# EAGLE design xcr3064xl_breakout (EAGLE 6.1)
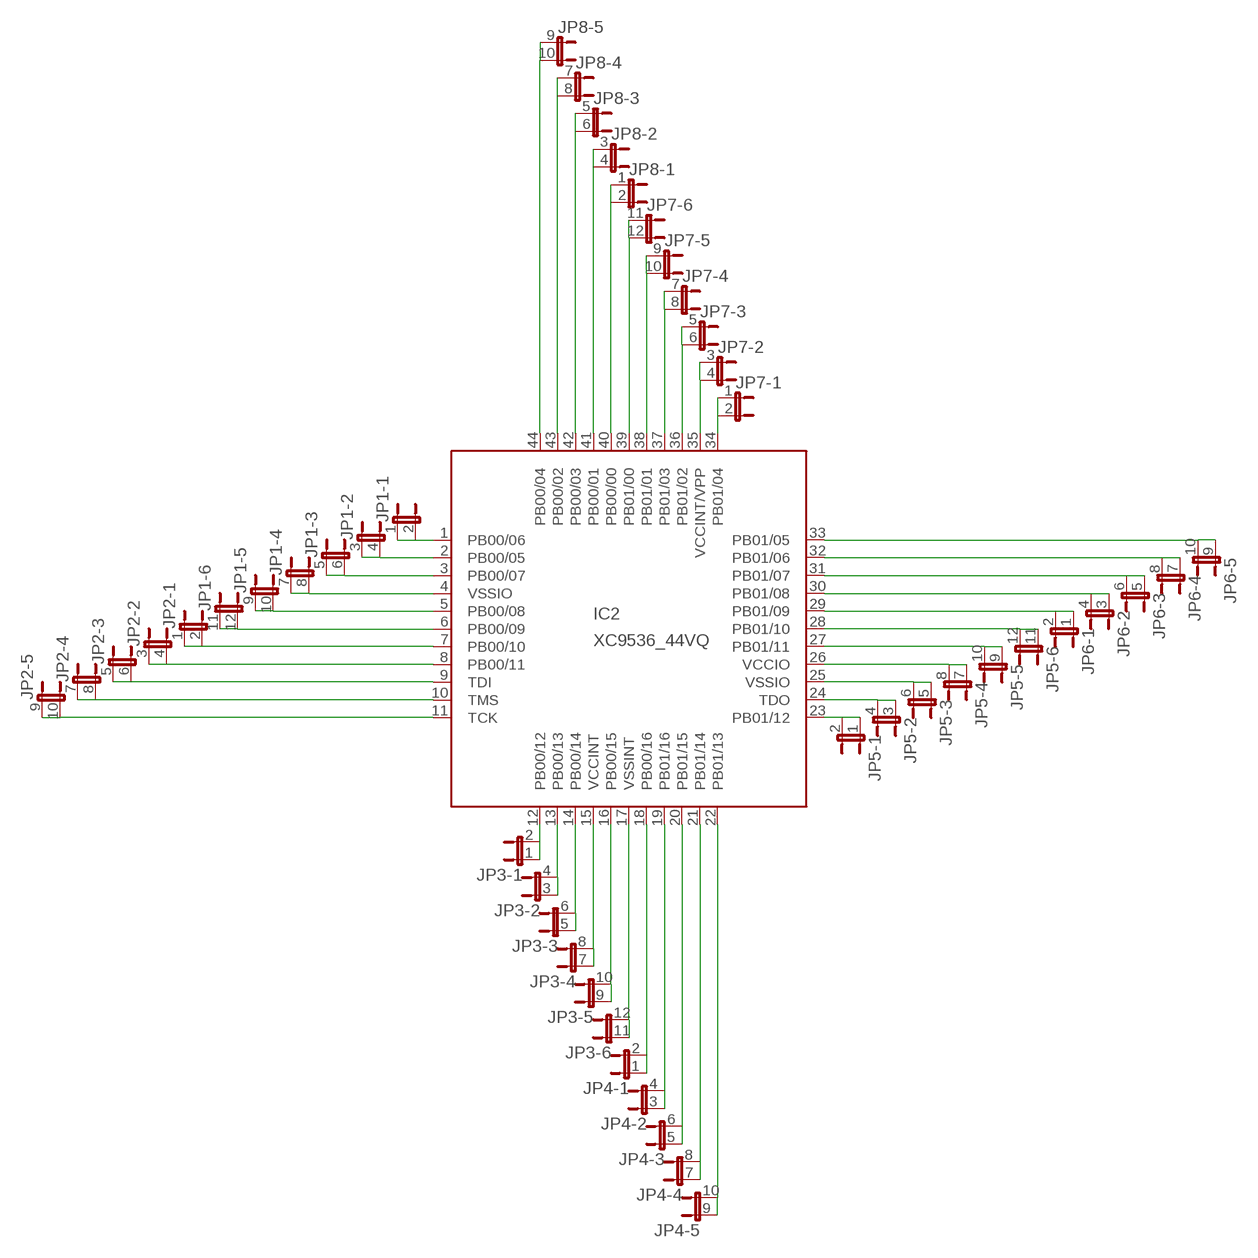
[diagram p0: schematic, sheet 1]

## Parts
IC2  XC9536_44VQ  [SQFP-S-10X10-44]
JP1  JP6QE  [JP6Q]
JP2  JP6QE  [JP6Q]
JP3  JP6QE  [JP6Q]
JP4  JP6QE  [JP6Q]
JP5  JP6QE  [JP6Q]
JP6  JP6QE  [JP6Q]
JP7  JP6QE  [JP6Q]
JP8  JP6QE  [JP6Q]

## Nets
N$1: IC2.1(PB00/06) JP1.1 JP1.2
N$2: IC2.2(PB00/05) JP1.3 JP1.4
N$3: IC2.3(PB00/07) JP1.5 JP1.6
N$4: IC2.4(VSSIO) JP1.7 JP1.8
N$5: IC2.5(PB00/08) JP1.9 JP1.10
N$6: IC2.6(PB00/09) JP1.11 JP1.12
N$7: IC2.7(PB00/10) JP2.1 JP2.2
N$8: IC2.8(PB00/11) JP2.3 JP2.4
N$9: IC2.9(TDI) JP2.5 JP2.6
N$10: IC2.10(TMS) JP2.7 JP2.8
N$11: IC2.11(TCK) JP2.9 JP2.10
N$12: IC2.12(PB00/12) JP3.1 JP3.2
N$13: IC2.13(PB00/13) JP3.3 JP3.4
N$14: IC2.14(PB00/14) JP3.5 JP3.6
N$15: IC2.15(VCCINT) JP3.7 JP3.8
N$16: IC2.16(PB00/15) JP3.9 JP3.10
N$17: IC2.17(VSSINT) JP3.11 JP3.12
N$18: IC2.18(PB00/16) JP4.1 JP4.2
N$19: IC2.19(PB01/16) JP4.3 JP4.4
N$20: IC2.20(PB01/15) JP4.5 JP4.6
N$21: IC2.21(PB01/14) JP4.7 JP4.8
N$22: IC2.22(PB01/13) JP4.9 JP4.10
N$23: IC2.23(PB01/12) JP5.1 JP5.2
N$24: IC2.24(TDO) JP5.3 JP5.4
N$25: IC2.25(VSSIO) JP5.5 JP5.6
N$26: IC2.26(VCCIO) JP5.7 JP5.8
N$27: IC2.27(PB01/11) JP5.9 JP5.10
N$28: IC2.28(PB01/10) JP5.11 JP5.12
N$29: IC2.29(PB01/09) JP6.1 JP6.2
N$30: IC2.30(PB01/08) JP6.3 JP6.4
N$31: IC2.31(PB01/07) JP6.5 JP6.6
N$32: IC2.32(PB01/06) JP6.7 JP6.8
N$33: IC2.33(PB01/05) JP6.9 JP6.10
N$34: IC2.34(PB01/04) JP7.1 JP7.2
N$35: IC2.35(VCCINT/VPP) JP7.3 JP7.4
N$36: IC2.36(PB01/02) JP7.5 JP7.6
N$37: IC2.37(PB01/03) JP7.7 JP7.8
N$38: IC2.38(PB01/01) JP7.9 JP7.10
N$39: IC2.39(PB01/00) JP7.11 JP7.12
N$40: IC2.40(PB00/00) JP8.1 JP8.2
N$41: IC2.41(PB00/01) JP8.3 JP8.4
N$42: IC2.42(PB00/03) JP8.5 JP8.6
N$43: IC2.43(PB00/02) JP8.7 JP8.8
N$44: IC2.44(PB00/04) JP8.9 JP8.10
Unconnected: JP2.11 JP2.12 JP4.11 JP4.12 JP6.11 JP6.12 JP8.11 JP8.12

## Library data of the parts
IC2 = xilinx-xc9:XC9536_44VQ: xc9536_pc44 XC9500 In-System Programmable CPLD Family Auto generated by make-symbol-device-package-bsdl.ulp Rev. 34 Source: xc9536_vq44.bsd; MPN: XC9536-15VQG44C; OC_FARNELL: 1193227; OC_NEWARK: 98K3377
JP1-JP8 = jumper:JP6QE: JUMPER

## Board
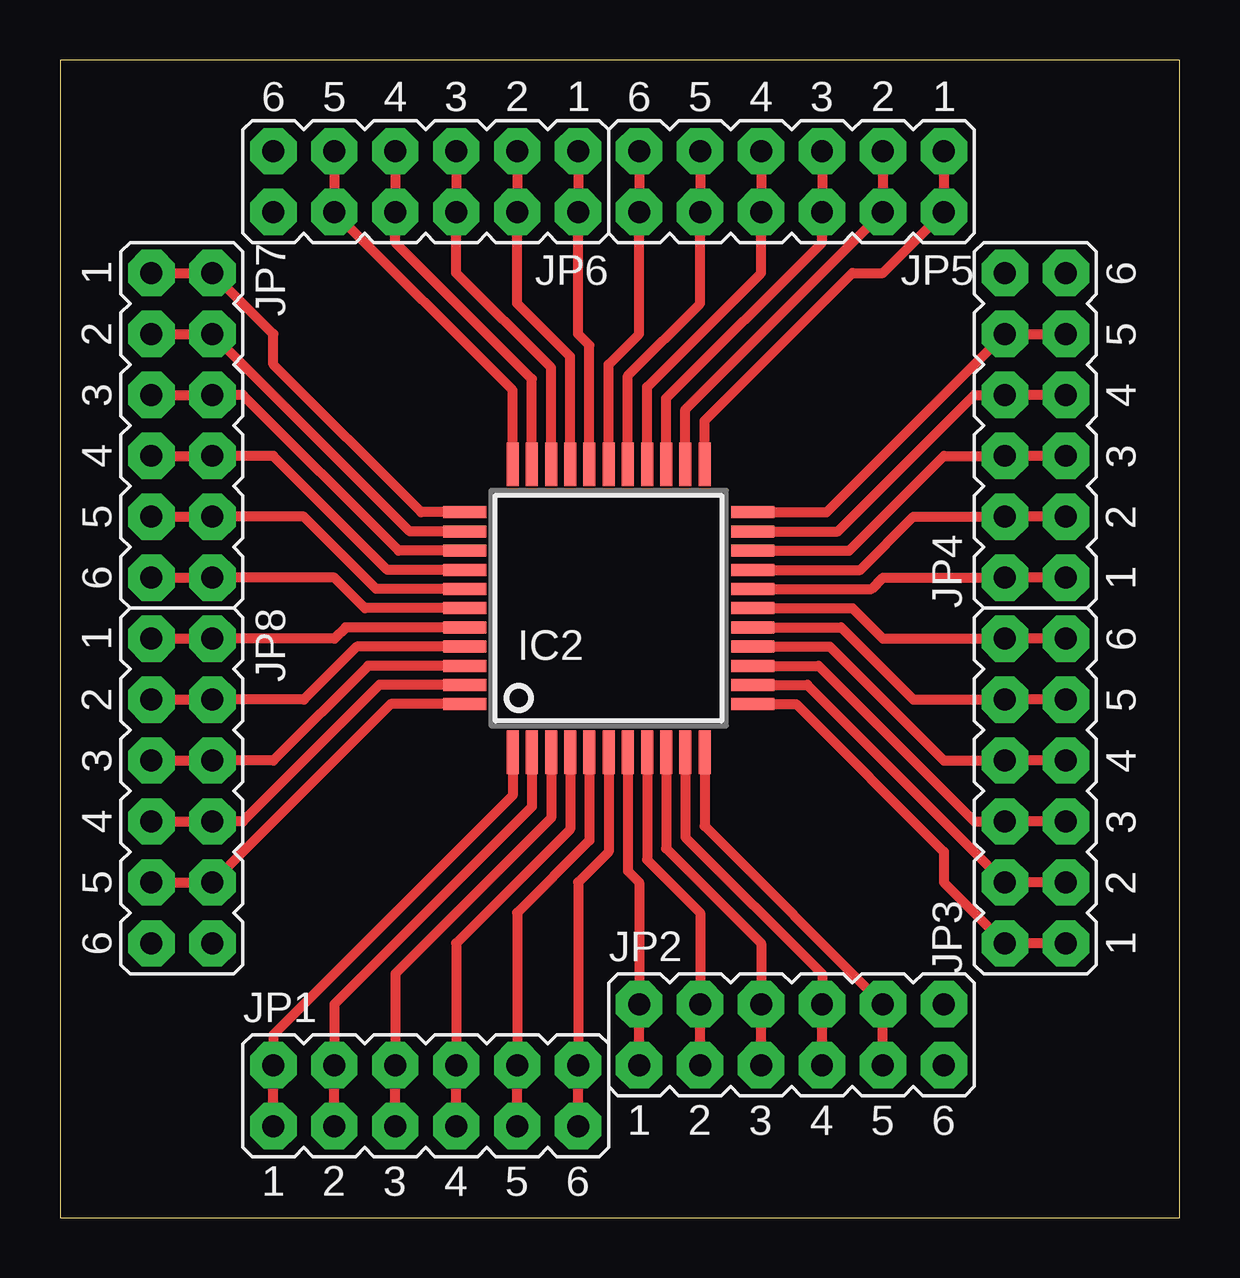
[diagram p1: board, top side]

Size 46.66 x 48.25 mm. Coordinates in mm from the lower left corner, seen from the top.
Outline: 0,0 46.66,0 46.66,48.25 0,48.25 0,0
Copper layers (1*16): Top 0.035mm / dielectric 1.5mm / Bottom 0.035mm
Design rules: minimum track width 10mil, minimum drill 24mil, track to track 8mil, track to pad 8mil, pad to pad 8mil, via to via 8mil, smd to smd 8mil, copper to edge 40mil, drill to drill 8mil, minimum pad ring 10mil, minimum via ring 8mil, stop-mask expansion 4mil, vias tented up to drill 0mil, thermal gap 10mil

### Footprints (pad centres in the part's own frame; a part is rotated, then mirrored left to right if it is on the bottom)
SQFP-S-10X10-44 = smd 0.5 x 1.8: 1 -4,-6; 2 -3.2,-6; 3 -2.4,-6; 4 -1.6,-6; 5 -0.8,-6; 6 0,-6; 7 0.8,-6; 8 1.6,-6; 9 2.4,-6; 10 3.2,-6; 11 4,-6; 23 4,6; 24 3.2,6; 25 2.4,6; 26 1.6,6; 27 0.8,6; 28 0,6; 29 -0.8,6; 30 -1.6,6; 31 -2.4,6; 32 -3.2,6; 33 -4,6 | smd 1.8 x 0.5: 12 6,-4; 13 6,-3.2; 14 6,-2.4; 15 6,-1.6; 16 6,-0.8; 17 6,0; 18 6,0.8; 19 6,1.6; 20 6,2.4; 21 6,3.2; 22 6,4; 34 -6,4; 35 -6,3.2; 36 -6,2.4; 37 -6,1.6; 38 -6,0.8; 39 -6,0; 40 -6,-0.8; 41 -6,-1.6; 42 -6,-2.4; 43 -6,-3.2; 44 -6,-4
JP6Q = drill 0.914 octagon: 1 -6.35,-1.27; 2 -6.35,1.27; 3 -3.81,-1.27; 4 -3.81,1.27; 5 -1.27,-1.27; 6 -1.27,1.27; 7 1.27,-1.27; 8 1.27,1.27; 9 3.81,-1.27; 10 3.81,1.27; 11 6.35,-1.27; 12 6.35,1.27

### Placement (x,y rotation side)
IC2  22.86,25.4 0 top
JP1  15.24,5.08 0 top
JP2  30.48,7.62 0 top
JP3  40.64,17.78 90 top
JP4  40.64,33.02 90 top
JP5  30.48,43.18 180 top
JP6  15.24,43.18 180 top
JP7  5.08,33.02 270 top
JP8  5.08,17.78 270 top

### Tracks (layer width: path | path; a pad name or v marks a point on that pad's centre or on a via)
N$1
  Top 0.406: IC2.1 18.86,17.59 8.89,7.62 JP1.2 JP1.1
N$2
  Top 0.406: IC2.2 19.66,17.12 11.43,8.89 JP1.4 JP1.3
N$3
  Top 0.406: IC2.3 20.46,16.65 13.97,10.16 JP1.6 JP1.5
N$4
  Top 0.406: IC2.4 21.26,16.18 16.51,11.43 JP1.8 JP1.7
N$5
  Top 0.406: IC2.5 22.06,15.71 19.05,12.7 JP1.10 JP1.9
N$6
  Top 0.406: IC2.6 22.86,15.24 21.59,13.97 JP1.12 JP1.11
N$7
  Top 0.406: IC2.7 23.66,14.44 24.13,13.97 JP2.2 JP2.1
N$8
  Top 0.406: IC2.8 24.46,14.91 26.67,12.7 JP2.4 JP2.3
N$9
  Top 0.406: IC2.9 25.26,15.38 29.21,11.43 JP2.6 JP2.5
N$10
  Top 0.406: IC2.10 26.06,15.85 31.75,10.16 JP2.8 JP2.7
N$11
  Top 0.406: IC2.11 26.86,16.32 JP2.10 JP2.9
N$12
  Top 0.406: IC2.12 30.67,21.4 36.83,15.24 36.83,13.97 JP3.2 JP3.1
N$13
  Top 0.406: IC2.13 31.14,22.2 JP3.4 JP3.3
N$14
  Top 0.406: IC2.14 31.61,23 38.1,16.51 JP3.6 JP3.5
N$15
  Top 0.406: IC2.15 32.08,23.8 36.83,19.05 JP3.8 JP3.7
N$16
  Top 0.406: IC2.16 32.55,24.6 35.56,21.59 JP3.10 JP3.9
N$17
  Top 0.406: IC2.17 33.02,25.4 34.29,24.13 JP3.12 JP3.11
N$18
  Top 0.406: IC2.18 33.82,26.2 34.29,26.67 JP4.2 JP4.1
N$19
  Top 0.406: IC2.19 33.35,27 35.56,29.21 JP4.4 JP4.3
N$20
  Top 0.406: IC2.20 32.88,27.8 36.83,31.75 JP4.6 JP4.5
N$21
  Top 0.406: IC2.21 32.41,28.6 38.1,34.29 JP4.8 JP4.7
N$22
  Top 0.406: IC2.22 31.94,29.4 JP4.10 JP4.9
N$23
  Top 0.406: IC2.23 26.86,33.21 33.02,39.37 34.29,39.37 JP5.2 JP5.1
N$24
  Top 0.406: IC2.24 26.06,33.68 JP5.4 JP5.3
N$25
  Top 0.406: IC2.25 25.26,34.15 31.75,40.64 JP5.6 JP5.5
N$26
  Top 0.406: IC2.26 24.46,34.62 29.21,39.37 JP5.8 JP5.7
N$27
  Top 0.406: IC2.27 23.66,35.09 26.67,38.1 JP5.10 JP5.9
N$28
  Top 0.406: IC2.28 22.86,35.56 24.13,36.83 JP5.12 JP5.11
N$29
  Top 0.406: IC2.29 22.06,36.36 21.59,36.83 JP6.2 JP6.1
N$30
  Top 0.406: IC2.30 21.26,35.89 19.05,38.1 JP6.4 JP6.3
N$31
  Top 0.406: IC2.31 20.46,35.42 16.51,39.37 JP6.6 JP6.5
N$32
  Top 0.406: IC2.32 19.66,34.95 13.97,40.64 JP6.8 JP6.7
N$33
  Top 0.406: IC2.33 18.86,34.48 JP6.10 JP6.9
N$34
  Top 0.406: IC2.34 15.05,29.4 8.89,35.56 8.89,36.83 JP7.2 JP7.1
N$35
  Top 0.406: IC2.35 14.58,28.6 JP7.4 JP7.3
N$36
  Top 0.406: IC2.36 14.11,27.8 7.62,34.29 JP7.6 JP7.5
N$37
  Top 0.406: IC2.37 13.64,27 8.89,31.75 JP7.8 JP7.7
N$38
  Top 0.406: IC2.38 13.17,26.2 10.16,29.21 JP7.10 JP7.9
N$39
  Top 0.406: IC2.39 12.7,25.4 11.43,26.67 JP7.12 JP7.11
N$40
  Top 0.406: IC2.40 11.9,24.6 11.43,24.13 JP8.2 JP8.1
N$41
  Top 0.406: IC2.41 12.37,23.8 10.16,21.59 JP8.4 JP8.3
N$42
  Top 0.406: IC2.42 12.84,23 8.89,19.05 JP8.6 JP8.5
N$43
  Top 0.406: IC2.43 13.31,22.2 7.62,16.51 JP8.8 JP8.7
N$44
  Top 0.406: IC2.44 13.78,21.4 JP8.10 JP8.9